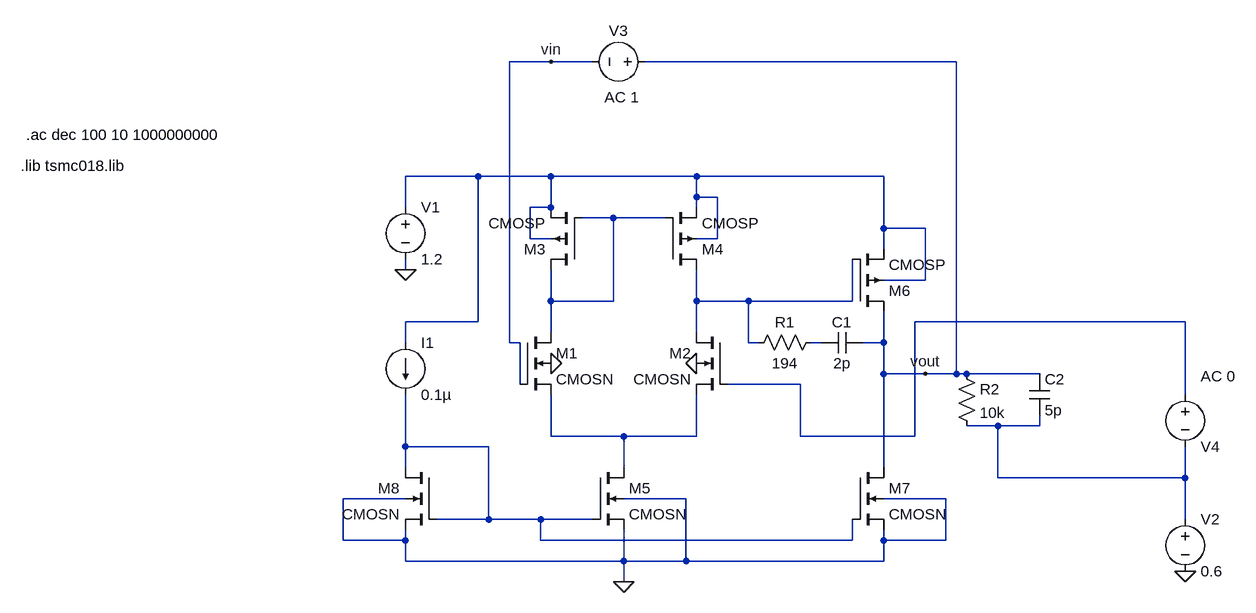
[diagram p0: schematic projectoutput.asc]
projectoutput.asc, the LTspice schematic file:
Version 4
SHEET 1 1152 680
WIRE 96 -464 32 -464
WIRE 160 -464 96 -464
WIRE 720 -464 240 -464
WIRE -16 -288 -128 -288
WIRE 96 -288 -16 -288
WIRE 320 -288 96 -288
WIRE 608 -288 320 -288
WIRE 320 -256 320 -288
WIRE 352 -256 320 -256
WIRE -128 -240 -128 -288
WIRE 96 -240 96 -288
WIRE 96 -240 64 -240
WIRE 320 -240 320 -256
WIRE 192 -224 144 -224
WIRE 272 -224 192 -224
WIRE 608 -208 608 -288
WIRE 672 -208 608 -208
WIRE 64 -192 64 -240
WIRE 96 -192 64 -192
WIRE 352 -192 352 -256
WIRE 352 -192 320 -192
WIRE 608 -176 608 -208
WIRE -128 -144 -128 -160
WIRE 672 -128 672 -208
WIRE 672 -128 608 -128
WIRE 96 -96 96 -144
WIRE 192 -96 192 -224
WIRE 192 -96 96 -96
WIRE 320 -96 320 -144
WIRE 400 -96 320 -96
WIRE 560 -96 560 -160
WIRE 560 -96 400 -96
WIRE -16 -64 -16 -288
WIRE -16 -64 -128 -64
WIRE 1072 -64 656 -64
WIRE 96 -48 96 -96
WIRE 320 -48 320 -96
WIRE -128 -32 -128 -64
WIRE 32 -32 32 -464
WIRE 48 -32 32 -32
WIRE 400 -32 400 -96
WIRE 416 -32 400 -32
WIRE 512 -32 496 -32
WIRE 608 -32 608 -80
WIRE 608 -32 576 -32
WIRE 608 16 608 -32
WIRE 672 16 608 16
WIRE 720 16 720 -464
WIRE 720 16 672 16
WIRE 736 16 720 16
WIRE 848 16 736 16
WIRE 48 32 48 -32
WIRE 480 32 368 32
WIRE 1072 48 1072 -64
WIRE 784 96 736 96
WIRE 848 96 848 80
WIRE 848 96 784 96
WIRE 96 112 96 48
WIRE 208 112 96 112
WIRE 320 112 320 48
WIRE 320 112 208 112
WIRE 480 112 480 32
WIRE 656 112 656 -64
WIRE 656 112 480 112
WIRE -128 128 -128 48
WIRE 0 128 -128 128
WIRE -128 160 -128 128
WIRE 208 160 208 112
WIRE 608 160 608 16
WIRE 784 176 784 96
WIRE 1072 176 1072 128
WIRE 1072 176 784 176
WIRE -128 208 -224 208
WIRE 304 208 208 208
WIRE 704 208 608 208
WIRE 0 240 0 128
WIRE 0 240 -80 240
WIRE 80 240 0 240
WIRE 160 240 80 240
WIRE 1072 240 1072 176
WIRE -224 272 -224 208
WIRE -128 272 -128 256
WIRE -128 272 -224 272
WIRE 80 272 80 240
WIRE 560 272 560 240
WIRE 560 272 80 272
WIRE 608 272 608 256
WIRE 704 272 704 208
WIRE 704 272 608 272
WIRE -128 304 -128 272
WIRE 208 304 208 256
WIRE 208 304 -128 304
WIRE 304 304 304 208
WIRE 304 304 208 304
WIRE 608 304 608 272
WIRE 608 304 304 304
WIRE 208 336 208 304
FLAG 208 336 0
FLAG -128 -144 0
FLAG 672 16 vout
FLAG 1072 320 0
FLAG 96 -464 vin
FLAG 96 0 0
FLAG 320 0 0
DATAFLAG 464 -288 ""
DATAFLAG 160 112 ""
DATAFLAG 512 112 ""
DATAFLAG 640 16 ""
DATAFLAG 48 240 ""
DATAFLAG 400 272 ""
DATAFLAG 336 -464 ""
DATAFLAG 1072 0 ""
DATAFLAG 352 -96 ""
DATAFLAG 96 -128 ""
SYMBOL nmos4 48 -48 R0
SYMATTR InstName M1
SYMATTR Value CMOSN
SYMATTR Value2 l=375n w=7.8u
SYMBOL nmos4 368 -48 M0
SYMATTR InstName M2
SYMATTR Value CMOSN
SYMATTR Value2 l=375n w=7.8u
SYMBOL nmos4 160 160 R0
SYMATTR InstName M5
SYMATTR Value CMOSN
SYMATTR Value2 l=1u w=664u
SYMBOL nmos4 560 160 R0
SYMATTR InstName M7
SYMATTR Value CMOSN
SYMATTR Value2 l=1u w=4700u
SYMBOL nmos4 -80 160 M0
SYMATTR InstName M8
SYMATTR Value CMOSN
SYMATTR Value2 l=1u w=1u
SYMBOL current -128 -32 R0
WINDOW 123 0 0 Left 0
WINDOW 39 0 0 Left 0
SYMATTR InstName I1
SYMATTR Value 0.1µ
SYMBOL voltage -128 -256 R0
WINDOW 123 0 0 Left 0
WINDOW 39 0 0 Left 0
SYMATTR InstName V1
SYMATTR Value 1.2
SYMBOL cap 576 -48 R90
WINDOW 0 0 32 VBottom 2
WINDOW 3 32 32 VTop 2
SYMATTR InstName C1
SYMATTR Value 2p
SYMBOL res 512 -48 R90
WINDOW 0 0 56 VBottom 2
WINDOW 3 32 56 VTop 2
SYMATTR InstName R1
SYMATTR Value 194
SYMBOL voltage 1072 224 R0
WINDOW 123 0 0 Left 0
WINDOW 39 0 0 Left 0
SYMATTR InstName V2
SYMATTR Value 0.6
SYMBOL pmos4 560 -80 M180
SYMATTR InstName M6
SYMATTR Value CMOSP
SYMATTR Value2 l=120n w=36u
SYMBOL pmos4 144 -144 R180
SYMATTR InstName M3
SYMATTR Value CMOSP
SYMATTR Value2 l=120n w=2.17u
SYMBOL pmos4 272 -144 M180
SYMATTR InstName M4
SYMATTR Value CMOSP
SYMATTR Value2 l=120n w=2.17u
SYMBOL res 720 0 R0
SYMATTR InstName R2
SYMATTR Value 10k
SYMBOL cap 832 16 R0
SYMATTR InstName C2
SYMATTR Value 5p
SYMBOL voltage 256 -464 R90
WINDOW 0 -32 56 VBottom 2
WINDOW 3 32 56 VTop 2
WINDOW 123 70 51 VBottom 2
WINDOW 39 0 0 Left 0
SYMATTR InstName V3
SYMATTR Value ""
SYMATTR Value2 AC 1
SYMBOL voltage 1072 32 R0
WINDOW 0 24 96 Left 2
WINDOW 3 24 16 Left 2
WINDOW 123 24 -12 Left 2
WINDOW 39 0 0 Left 0
SYMATTR InstName V4
SYMATTR Value ""
SYMATTR Value2 AC 0
TEXT -720 -304 Left 2 !.lib tsmc018.lib
TEXT -712 -352 Left 2 !.ac dec 100 10 1000000000

The netlist it stands for:
* projectoutput.asc
M1 N002 vin N007 0 CMOSN l=375n w=7.8u
M2 N003 N004 N007 0 CMOSN l=375n w=7.8u
M5 N007 N008 0 0 CMOSN l=1u w=664u
M7 vout N008 0 0 CMOSN l=1u w=4700u
M8 N008 N008 0 0 CMOSN l=1u w=1u
I1 N001 N008 0.1µ
V1 N001 0 1.2
C1 vout N005 2p
R1 N005 N003 194
V2 N006 0 0.6
M6 vout N003 N001 N001 CMOSP l=120n w=36u
M3 N002 N002 N001 N001 CMOSP l=120n w=2.17u
M4 N003 N002 N001 N001 CMOSP l=120n w=2.17u
R2 vout N006 10k
C2 vout N006 5p
V3 vout vin AC 1
V4 N004 N006 AC 0
.model NMOS NMOS
.model PMOS PMOS
.lib standard.mos
.lib tsmc018.lib
.ac dec 100 10 1000000000
.backanno
.end